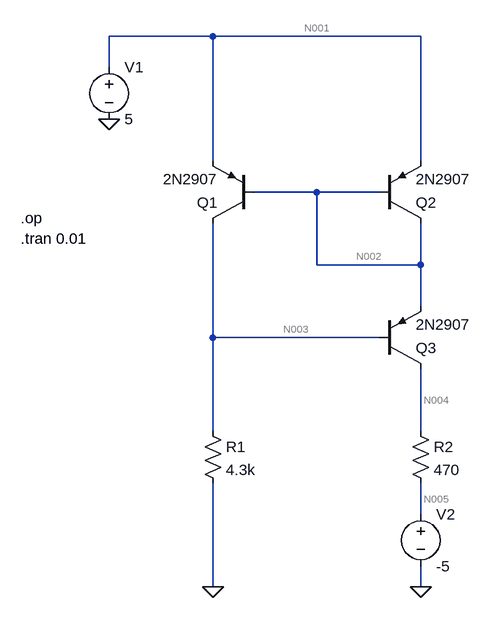
[diagram p0: schematic Draft1.asc]
Draft1.asc, the LTspice schematic file:
Version 4
SHEET 1 880 832
WIRE 320 -32 160 -32
WIRE 640 -32 320 -32
WIRE 160 16 160 -32
WIRE 320 160 320 -32
WIRE 640 160 640 -32
WIRE 480 208 384 208
WIRE 576 208 480 208
WIRE 480 320 480 208
WIRE 640 320 640 256
WIRE 640 320 480 320
WIRE 640 384 640 320
WIRE 320 432 320 256
WIRE 576 432 320 432
WIRE 320 576 320 432
WIRE 640 576 640 480
WIRE 640 704 640 656
WIRE 320 816 320 656
WIRE 640 816 640 784
FLAG 160 96 0
FLAG 640 816 0
FLAG 320 816 0
SYMBOL voltage 160 0 R0
SYMATTR InstName V1
SYMATTR Value 5
SYMBOL pnp 384 256 R180
SYMATTR InstName Q1
SYMATTR Value 2N2907
SYMBOL pnp 576 256 M180
SYMATTR InstName Q2
SYMATTR Value 2N2907
SYMBOL pnp 576 480 M180
SYMATTR InstName Q3
SYMATTR Value 2N2907
SYMBOL res 304 560 R0
SYMATTR InstName R1
SYMATTR Value 4.3k
SYMBOL res 624 560 R0
SYMATTR InstName R2
SYMATTR Value 470
SYMBOL voltage 640 688 R0
SYMATTR InstName V2
SYMATTR Value -5
TEXT 24 248 Left 2 !.op\n.tran 0.01

The netlist it stands for:
* Draft1.asc
V1 N001 0 5
Q1 N003 N002 N001 0 2N2907
Q2 N002 N002 N001 0 2N2907
Q3 N004 N003 N002 0 2N2907
R1 N003 0 4.3k
R2 N004 N005 470
V2 N005 0 -5
.model NPN NPN
.model PNP PNP
.lib standard.bjt
.op
.tran 0.01
.backanno
.end

* Results of the author's LTspice run, read from the files saved beside the schematic
* Operating Point, zero values left out:
*   V(n001) = 5 V
*   V(n003) = 3.699 V
*   V(n002) = 4.349 V
*   V(n004) = -4.598 V
*   V(n005) = -5 V
*   Ic(Q3) = -856.1 µA
*   Ib(Q3) = -3.211 µA
*   Ie(Q3) = 859.3 µA
*   Ic(Q2) = -852.5 µA
*   Ib(Q2) = -3.42 µA
*   Ie(Q2) = 855.9 µA
*   Ic(Q1) = -857 µA
*   Ib(Q1) = -3.419 µA
*   Ie(Q1) = 860.5 µA
*   I(R2) = 856.1 µA
*   I(R1) = 860.3 µA
*   I(V2) = 856.1 µA
*   I(V1) = -1.716 mA